# EAGLE design CV_slew_limiter (EAGLE 9.3.0)
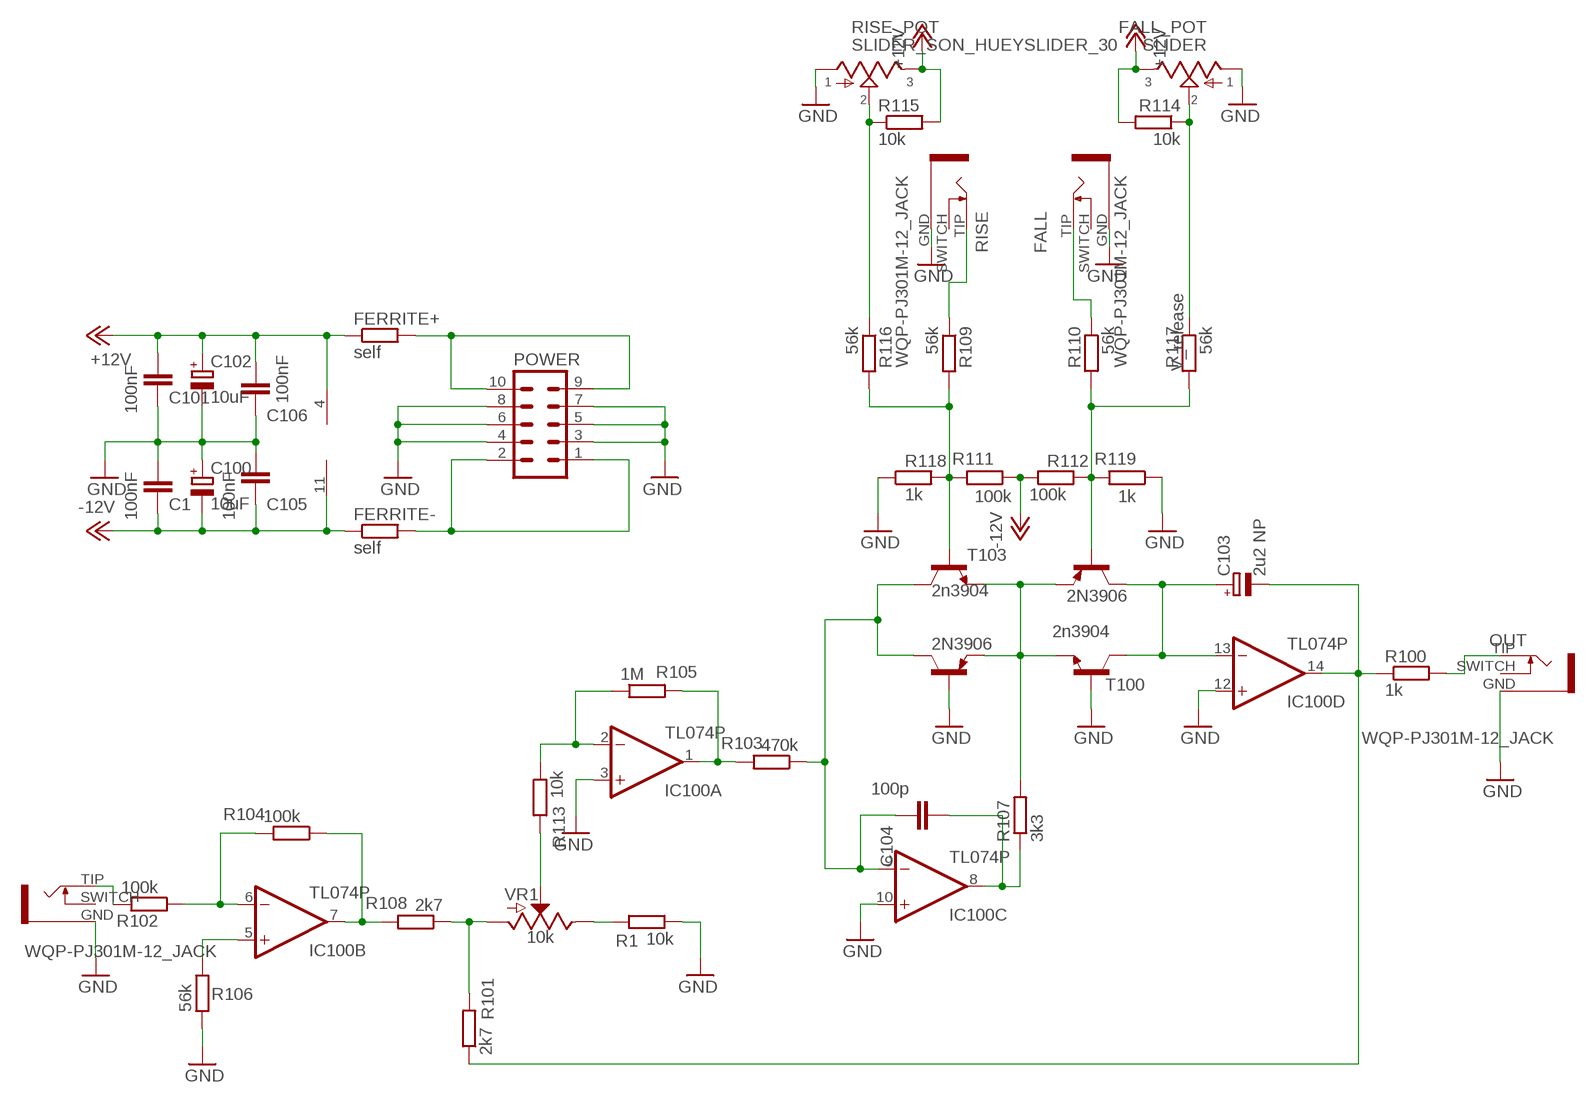
[diagram p0: schematic, sheet 1]

## Parts
C1  100nF  C-EU050-025X075  [C050-025X075]
C100  10uF  CPOL-EUE2-4  [E2-4]
C101  100nF  C-EU050-025X075  [C050-025X075]
C102  10uF  CPOL-EUE2-4  [E2-4]
C103  2u2 NP  CPOL-EUE2-4  [E2-4]
C104  100p  C-EU050-025X075  [C050-025X075]
C105  100nF  C-EU050-025X075  [C050-025X075]
C106  100nF  C-EU050-025X075  [C050-025X075]
FALL  WQP-PJ301M-12_JACK  [WQP-PJ301M-12_JACK]
FALL_POT  SLIDER  SLIDER_SON_HUEYSLIDER_30  [SILDER_30]
FERRITE+  self  R-EU_0204/5  [0204/5]
FERRITE-  self  R-EU_0204/5  [0204/5]
IC100  TL074P  [DIL14]
IN  WQP-PJ301M-12_JACK  [WQP-PJ301M-12_JACK]
OUT  WQP-PJ301M-12_JACK  [WQP-PJ301M-12_JACK]
POWER  ML10  [ML10]
R1  10k  R-EU_0204/5  [0204/5]
R100  1k  R-EU_0204/5  [0204/5]
R101  2k7  R-EU_0204/5  [0204/5]
R102  100k  R-EU_0204/5  [0204/5]
R103  470k  R-EU_0204/5  [0204/5]
R104  100k  R-EU_0204/5  [0204/5]
R105  1M  R-EU_0204/5  [0204/5]
R106  56k  R-EU_0204/5  [0204/5]
R107  3k3  R-EU_0204/5  [0204/5]
R108  2k7  R-EU_0204/5  [0204/5]
R109  56k  R-EU_0204/5  [0204/5]
R110  56k  R-EU_0204/5  [0204/5]
R111  100k  R-EU_0204/5  [0204/5]
R112  100k  R-EU_0204/5  [0204/5]
R113  10k  R-EU_0204/5  [0204/5]
R114  10k  R-EU_0204/5  [0204/5]
R115  10k  R-EU_0204/5  [0204/5]
R116  56k  R-EU_0204/5  [0204/5]
R117  56k  R-EU_0204/5  [0204/5]
R118  1k  R-EU_0204/5  [0204/5]
R119  1k  R-EU_0204/5  [0204/5]
RISE  WQP-PJ301M-12_JACK  [WQP-PJ301M-12_JACK]
RISE_POT  SLIDER_SON_HUEYSLIDER_30  [SILDER_30]
T100  2n3904  2N3904-NPN-TO92-EBC  [TO92-EBC]
T101  2N3906  2N3906-PNP-TO92-EBC  [TO92-EBC]
T102  2N3906  2N3906-PNP-TO92-EBC  [TO92-EBC]
T103  2n3904  2N3904-NPN-TO92-EBC  [TO92-EBC]
VR1  10k  POTENTIOMETER-PTH-9MM-1/20W-20%  [POT-PTH-ALPS]

## Nets
+12V: C101.2 C102.+ C106.2 FALL_POT.3 FERRITE+.1 IC100.4(P:V+) R114.2 R115.2 RISE_POT.3
-12V: C1.1 C100.- C105.1 FERRITE-.1 IC100.11(P:V-) R111.1 R112.1
GND: C1.2 C100.+ C101.1 C102.- C105.2 C106.1 FALL.GND FALL_POT.1 IC100.3(A:+IN) IC100.10(C:+IN) IC100.12(D:+IN) IN.GND OUT.GND POWER.3 POWER.4 POWER.5 POWER.6 POWER.7 POWER.8 R1.1 R106.2 R118.1 R119.1 RISE.GND RISE_POT.1 T100.B T102.B
IC25: C103.- IC100.14(D:OUT) R100.1 R101.1
N$1: OUT.TIP R100.2
N$2: R113.2 VR1.P$2(S)
N$3: R101.2 R108.1 VR1.P$3(A)
N$4: IN.TIP R102.2
N$5: R1.2 VR1.P$1(E)
N$8: FERRITE+.2 POWER.9 POWER.10
N$10: R107.2 T100.E T101.E T102.E T103.E
N$12: C103.+ IC100.13(D:-IN) T100.C T101.C
N$21: IC100.2(A:-IN) R105.1 R113.1
N$22: C104.1 IC100.9(C:-IN) R103.1 T102.C T103.C
N$23: C104.2 IC100.8(C:OUT) R107.1
N$24: R109.1 RISE.TIP
N$28: IC100.1(A:OUT) R103.2 R105.2
N$30: IC100.7(B:OUT) R104.1 R108.2
N$33: FERRITE-.2 POWER.1 POWER.2
N$35: IC100.6(B:-IN) R102.1 R104.2
N$37: IC100.5(B:+IN) R106.1
N$46: R115.1 R116.1 RISE_POT.2
N$49: FALL_POT.2 R114.1 R117.1
N$51: FALL.TIP R110.1
TO_ATTACK_CV: R109.2 R111.2 R116.2 R118.2 T103.B
TO_DECCAY_CV: R110.2 R112.2 R117.2 R119.2 T101.B
Unconnected: FALL.SWITCH IN.SWITCH OUT.SWITCH RISE.SWITCH

## Notes on the sheet
- V_release

## Library data of the parts
C1 C101 C104-C106 = rcl:C-EU: CAPACITOR, European symbol
C100 C102 C103 = rcl:CPOL-EU: POLARIZED CAPACITOR, European symbol
FALL IN OUT RISE = thonkiconn:WQP-PJ301M-12_JACK
FALL_POT RISE_POT = slider_son_huey:SLIDER_SON_HUEY
FERRITE+ FERRITE- R1 R100-R119 = rcl:R-EU_: RESISTOR, European symbol
IC100 = linear:TL074: OP AMP
POWER = con-ml:ML10: HARTING; OC_FARNELL: unknown; OC_NEWARK: unknown
T100 T103 = transistor-neu-to92:*-NPN-: NPN Transistror
T101 T102 = transistor-neu-to92:*-PNP-: PNP Transistror
VR1 = SparkFun-Resistors:POTENTIOMETER: Potentiometer (Pot) Three-terminal potentiometers, with an adjustable wiper and two adjustable resistors. A pot can be used to create a configurable voltage divider, or as a variable resistor. Variants ALPS_POT and ALPS_POT_KIT - PTH, breadboard compatible, 9mm square pots Rotary Potentiometer - Linear (10k ohm) <https://www.sparkfun.com/products/9288> (COM-09288) The KIT variant exposes copper on only one side of the PTH pad, so the part can only be assembled on one side of the PCB. Useful for beginner soldering kits.; PROD_ID: RES-09177; SF_SKU: COM-09288

## Board
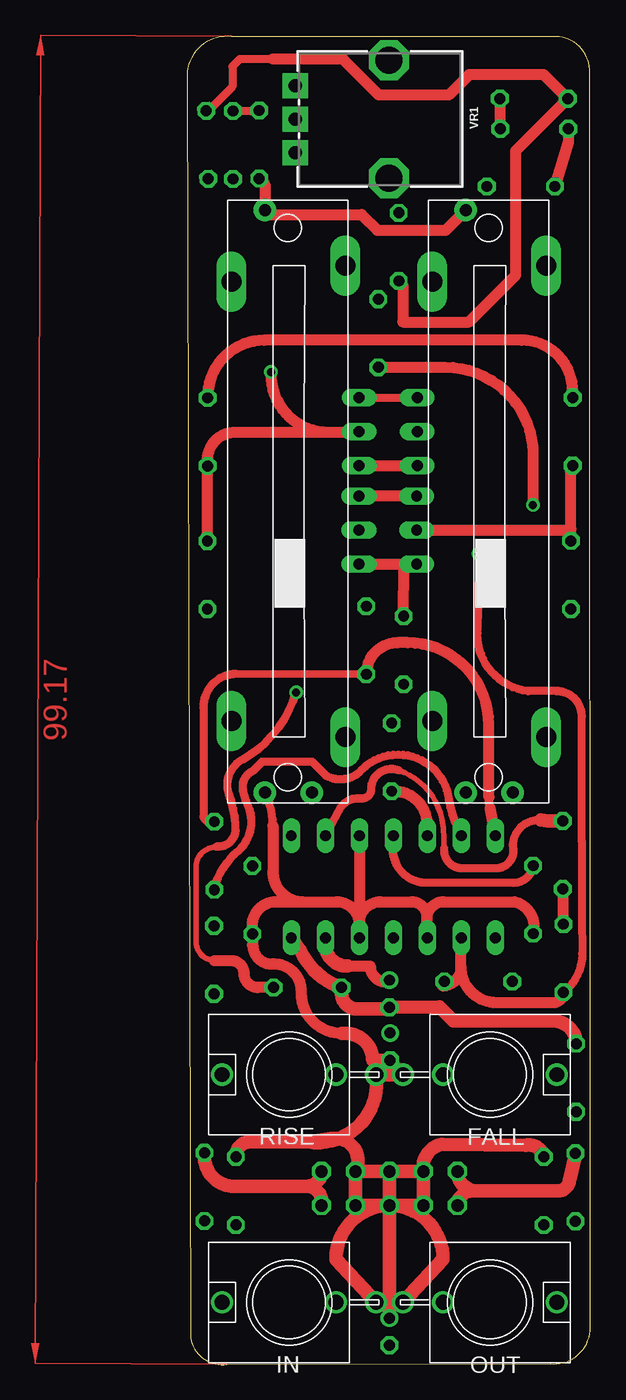
[diagram p1: board, top side]
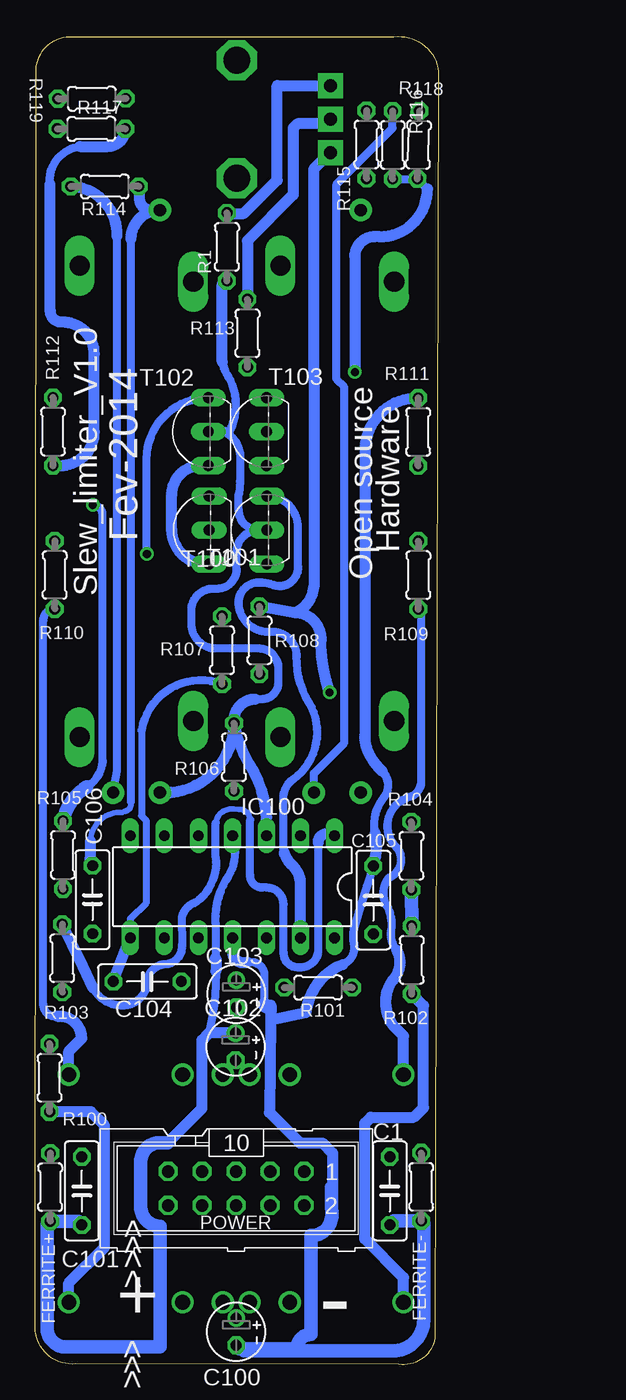
[diagram p2: board, bottom side, seen from below]

Size 30.12 x 99.16 mm. Coordinates in mm from the lower left corner, seen from the top.
Outline: 0,96.53 0.27,1.98 arc90 2.97,0.03 27.12,0.06 arc90 30.12,2.55 30.07,96.72 arc90 27.32,99.14 3.32,99.14 arc90 0,96.53
Copper layers (1*16): Top 0.035mm / dielectric 1.5mm / Bottom 0.035mm
Design rules "default": minimum track width 6mil, minimum drill 12mil, track to track 6mil, track to pad 6mil, pad to pad 6mil, via to via 6mil, smd to smd 0mil, copper to edge 10mil, drill to drill 10mil, minimum pad ring 10mil, minimum via ring 6mil, stop-mask expansion 2mil, vias tented up to drill 100mil, thermal gap 10mil

### Footprints (pad centres in the part's own frame; a part is rotated, then mirrored left to right if it is on the bottom)
C050-025X075 = drill 0.813 octagon: 1 -2.54,0; 2 2.54,0
E2-4 = drill 0.813 pad 1.27: + -1.016,0 | drill 0.813 pad 1.27 octagon: - 1.016,0
WQP-PJ301M-12_JACK = drill 1.1: GND 0,-6.5; SWITCH 0,-3.5; TIP 0,5
SILDER_30 = drill 0.9 pad 1.676: 1 -21.75,1.8; 2 -21.75,-1.7; 3 21.75,1.8 | drill 1.5 long: P$4 -17.6,-4.2; P$5 -16.4,4.3; P$6 16.4,4.3; P$7 17.6,-4.2
0204/5 = drill 0.813 octagon: 1 -2.54,0; 2 2.54,0
DIL14 = drill 0.813 long: 1 -7.62,-3.81; 2 -5.08,-3.81; 3 -2.54,-3.81; 4 0,-3.81; 5 2.54,-3.81; 6 5.08,-3.81; 7 7.62,-3.81; 8 7.62,3.81; 9 5.08,3.81; 10 2.54,3.81; 11 0,3.81; 12 -2.54,3.81; 13 -5.08,3.81; 14 -7.62,3.81
ML10 = drill 0.914 octagon: 1 -5.08,-1.27; 2 -5.08,1.27; 3 -2.54,-1.27; 4 -2.54,1.27; 5 0,-1.27; 6 0,1.27; 7 2.54,-1.27; 8 2.54,1.27; 9 5.08,-1.27; 10 5.08,1.27
TO92-EBC = drill 0.813 long: B 0,-1.27; C 2.54,-1.27; E -2.54,-1.27
POT-PTH-ALPS = drill 1 pad 1.88 square: P$1 7,-2.5; P$2 7,0; P$3 7,2.5 | drill 2 octagon: P$4 0,-4.4; P$5 0,4.4

### Placement (x,y rotation side)
C1  3.65,12.97 90 bottom
C100  15.12,2.46 270 bottom
C101  26.65,12.97 270 bottom
C102  15.17,23.74 270 bottom
C103  15.11,27.69 270 bottom
C104  21.76,28.6 180 bottom
C105  4.88,34.69 270 bottom
C106  25.85,34.71 90 bottom
FALL  22.62,21.65 270 top
FALL_POT  22.62,64.45 90 top
FERRITE+  29.01,13.25 90 bottom
FERRITE-  1.3,13.27 90 bottom
IC100  15.41,35.68 180 bottom
IN  7.62,4.65 90 top
OUT  22.62,4.65 270 top
POWER  15.12,13.15 180 bottom
R1  15.81,83.45 90 bottom
R100  29.06,21.42 270 bottom
R101  9,28.16 0 bottom
R102  2.01,30.21 270 bottom
R103  28.11,30.34 90 bottom
R104  2.03,37.99 270 bottom
R105  28.06,38.05 270 bottom
R106  15.28,45.35 90 bottom
R107  16.18,53.34 90 bottom
R108  13.39,54.08 270 bottom
R109  1.51,58.95 90 bottom
R110  28.67,58.96 90 bottom
R111  1.53,69.64 270 bottom
R112  28.8,69.66 270 bottom
R113  14.28,77.01 90 bottom
R114  24.93,87.96 0 bottom
R115  5.38,91.09 270 bottom
R116  3.43,91.06 270 bottom
R117  25.94,92.27 0 bottom
R118  1.51,91.08 268.3 bottom
R119  25.9,94.52 0.1 bottom
RISE  7.62,21.65 90 top
RISE_POT  7.62,64.45 90 top
T100  14.11,62.31 90 bottom
T101  18.42,62.32 90 bottom
T102  18.47,69.65 90 bottom
T103  14.12,69.67 90 bottom
VR1  15.08,92.98 180 top

### Tracks (layer width: path | path; a pad name or v marks a point on that pad's centre or on a via)
+12V
  Top 0.61: IC100.4 15.36,38.66 arc90 17.7,35.99 24.24,35.99 arc90 C106.2
  Top 0.813: FALL_POT.3 19.31,84.7 14.22,84.7 13.04,85.87 6.16,85.87 RISE_POT.3 5.82,88.11 R115.2
  Bottom 0.406: 22.97,42.02 arc90 23.47,41.3 23.65,41.24 arc-90 26.01,39.09
  Bottom 0.61: IC100.4 arc55 15.87,36.19 arc-31 16.66,33.01 16.66,30.34 | 22.97,42.02 22.97,84.06 | FALL_POT.3 21.49,86.2 | 22.34,87.96 arc-90 R114.2 | 16.64,29.4 arc16 17.15,24.8 arc-21 17.15,24.76
  Bottom 0.813: 26.01,39.09 26.01,37.8 arc-90 C106.2 | 22.97,84.06 arc90 FALL_POT.3 | 21.49,86.2 arc90 22.34,87.06 22.34,87.96 | C102.+ 17.15,24.76 17.68,24.23 17.68,19.13 20.23,16.58 | 16.66,30.34 16.64,30.31 16.64,29.4
  Bottom 1.016: 20.23,16.58 20.81,16.58 arc-90 22.26,15.13 22.26,11.8 arc-90 20.78,10.32 20.78,1.32 27.98,1.32 arc90 29.24,2.92 29.24,10.48 FERRITE+.1 26.93,10.71 C101.2
-12V
  Top 0.813: R112.1 28.8,72.68 arc90 24.99,76.49 5.75,76.49 arc90 R111.1
  Bottom 0.61: 13.01,27.03 13.02,29.02 arc-90 13.91,30.04 14.31,30.04 | 4.74,39.68 arc50 4.08,42.35 arc-86 4.22,44.32 | C105.1 arc-3 6.28,32.73 arc-27 6.33,31.44 arc80 7.18,29.86
  Bottom 0.813: 12.55,25.71 12.53,26.84 12.58,26.83 12.6,26.82 arc141 13.01,26.73 13.01,27.03 | 12.55,25.71 12.64,18.82 10.37,16.55 8.68,16.55 7.92,15.79 7.92,13.33 8,13.24 | 14.31,30.04 arc90 15.35,30.56 15.34,31.85 arc-90 IC100.11 | C105.1 arc-31 4.74,39.68 | 4.22,44.32 arc21 5.24,45.7 arc33 5.47,47.14 5.47,68.32 arc90 R111.1 | 7.18,29.86 arc-61 9.94,26.27 12.55,25.71
  Bottom 1.016: 8,13.24 arc-4 7.98,11.23 arc93 9.52,9.65 9.52,2.26 arc-90 10.58,1.2 14.87,1.2 C100.- 14.91,1.45 14.52,1.05 3.2,1.05 arc-90 1.12,3.53 1.12,10.55 arc-90 FERRITE-.1 3.35,10.73 C1.1
GND
  Top 0.61: POWER.7 17.66,14.47 | 6.4,40.24 arc26 RISE_POT.1 | 6.42,97.46 3.93,97.46 3.39,96.92 3.39,95.41 1.59,93.61 R118.1
  Top 0.813: 8.65,34.56 6.64,34.56 arc90 4.88,32.8 C105.2 4.88,31.33 4.93,31.29 arc90 6.31,29.9 6.52,29.9 arc-90 8.54,27.89 8.54,27.75 arc90 11.56,24.72 | 8.65,34.56 11.16,34.56 arc-90 12.85,32.87 12.85,32.02 arc-90 IC100.12 | IC100.12 12.85,32.94 arc-90 14.47,34.56 16.77,34.56 arc-90 17.91,33.41 17.91,32.03 arc90 IC100.10 17.93,33.32 arc-90 19.16,34.56 24.46,34.56 arc-90 C106.1 | IC100.3 IC100.12 | 6.4,40.24 6.4,36.81 arc90 8.65,34.56 | R1.1 16.11,80.61 16.11,77.85 21.07,77.85 24.55,81.33 24.55,90.62 R119.1 26.64,96.32 21.08,96.32 19.55,94.79 14.32,94.79 11.65,97.46 6.42,97.46
  Top 1.016: 17.66,14.47 arc-90 19.05,16.45 25.31,16.38 arc-90 C101.1 | POWER.6 POWER.4 POWER.3 | POWER.6 POWER.8 POWER.7 POWER.5 | 9.07,16.62 arc106 RISE.GND FALL.GND 15.17,22.61 C102.- 13.87,22.73 arc90 11.87,24.72 11.56,24.72 | 9.07,16.62 10.81,16.89 arc-126 POWER.3 | IN.GND 11.12,7.88 arc-90 POWER.6 | OUT.GND 19.12,7.88 arc90 POWER.6 | POWER.6 C100.+ | C1.2 3.65,15.6 arc-90 4.68,16.63 9.06,16.63 arc-90 9.07,16.62 | POWER.6 POWER.5 | POWER.3 POWER.5
  Bottom 0.61: T102.B 16.15,69.7 | 16.15,69.7 arc66 14.83,67.85 arc7 14.91,65.01 arc-90 14.93,64.99 14.93,63.81 arc-90 13.44,62.31 | 16.16,74.87 arc-26 15.56,73.52 arc50 15.63,69.64 arc-21 16.15,69.7 | T100.B 13.44,62.31 | 13.44,62.31 arc-90 15.08,60.66 15.08,59.38 arc90 16.52,57.94 16.83,57.94 arc-90 18.46,56.31 18.46,55.29 arc-90 16.63,53.47 13.43,53.47 arc90 11.96,52 11.96,50.93 arc90 13.2,49.7 13.68,49.7 | R106.2 15.28,48.09
  Bottom 0.813: FALL_POT.1 20.47,42.7 arc-90 R106.2 arc-22 13.76,44.16 arc33 IC100.3 | 15.28,48.09 arc90 13.68,49.7 | 16.16,74.87 16.16,80.56 arc90 R1.1
IC25
  Top 1.016: IC100.14 arc-6 8.72,30.49 arc43 R101.1 11.54,27.73 arc90 12.71,26.56 15,26.56 arc-90 C103.- 18.85,26.7 19.88,25.67 27.35,25.67 arc-90 R100.1
N$1
  Bottom 0.813: OUT.TIP 27.62,6.1 24.96,8.76 24.96,17.86 25.97,18.88 R100.2
N$2
  Bottom 0.813: VR1.P$2 8.44,92.63 10.56,92.63 10.86,92.33 10.86,87.33 14.28,83.91 R113.2
N$3  (via drill 0.6 pad 1.02)
  Top 0.406: 2.17,38.66 arc90 0.66,37.06 0.66,31.66 arc90 2.05,30.17
  Top 0.61: v8.14,50.19 arc-44 4.17,45.2 arc82 3.14,42.56 arc-20 3.63,39.86 arc-90 2.24,38.69 2.17,38.66
  Top 0.813: 2.05,30.17 3.27,30.17 arc-90 4.26,29.19 arc90 5.29,28.16 R101.2
  Bottom 0.813: R108.1 10.7,56.14 | 10.7,56.14 arc-62 9.33,58.07 9.33,89.24 VR1.P$3 | v8.14,50.19 arc17 8.8,53.91 arc-97 10.7,56.14
N$4
  Bottom 0.813: IN.TIP 2.62,6.5 5.51,9.39 5.51,18.03 5.07,18.46 1.85,18.46 1.13,19.18 1.13,26.8 R102.2
N$5
  Bottom 0.813: R1.2 15.76,85.94 14.56,85.94 12.07,88.42 12.07,95.48 VR1.P$1
N$8
  Top 1.016: FERRITE+.2 29.01,15.57 28.57,13.85 arc-90 27.69,12.97 21.65,12.97 | 21.65,12.97 arc-90 POWER.9 | POWER.10 arc-90 21.29,12.97 21.65,12.97
N$10
  Top 0.61: T101.E arc-90 T101.E 16.13,59.77 arc-90 16.21,59.7 | 17.14,67.13 arc90 T102.E
  Top 0.813: T100.E 16.13,59.77 | T103.E 17.14,67.13 | R107.2 16.21,59.7
  Bottom 0.813: T101.E 17.37,59.78 arc90 19.93,62.33 19.93,64.94 arc90 17.73,67.14 17.19,67.14 arc-90 T102.E
N$12
  Top 0.61: T100.C arc90 T100.C
  Top 0.813: T101.C T100.C | 11.97,29.76 13.68,29.76 arc90 14.88,28.56 arc-90 15.03,28.71 C103.+
  Top 1.016: IC100.13 10.31,31.42 arc90 11.97,29.76
  Bottom 0.61: 11.53,38.22 arc25 11.59,38.82 11.59,42.27 arc54 10.84,43.74 arc-86 9.68,49.43 arc33 10.6,52.85 arc-96 12.54,54.71 arc90 14.94,56.77 arc93 13.44,58.41 arc21 12.36,58.22 arc-118 10.51,59.7 10.51,62.52 arc-90 T100.C
  Bottom 0.813: IC100.13 10.32,35.91 arc-47 10.89,37.23 arc28 11.53,38.22
N$21  (via drill 0.6 pad 1.02)
  Top 0.406: 15.8,44.38 arc-59 19.03,40.75 arc-11 19.19,38.58
  Top 0.61: IC100.2 11.53,41.7 arc-58 12.97,42.28 arc97 13.76,42.98 arc-112 15.8,44.38 | 19.19,38.58 arc96 20.53,37.07 23.21,37.07 arc90 23.21,37.08 arc96 24.35,38.61 arc-99 26.41,40.65
  Top 0.813: R113.1 19.28,74.47 arc-90 25.84,67.9 v25.84,64.19 arc-90 v25.83,64.18
  Top 1.016: 26.41,40.65 arc12 R105.1
  Bottom 0.61: 26.27,43.14 arc-53 25.08,45.01 25.08,45.05 arc-90 25.1,45.07 25.1,63.45 arc-90 v25.83,64.18
  Bottom 1.016: 26.27,43.14 arc-47 R105.1
N$22  (via drill 0.6 pad 1.02)
  Top 0.61: T103.C 17.14,72.21 arc90 T102.C | v21.79,60.53 arc90 21.86,60.46 21.72,55 arc90 25.46,50.29 27.59,50.29 arc-90 29.49,48.39 29.49,39.04 arc0 29.52,30.69 arc-53 R103.1
  Top 0.813: C104.1 19.09,28.29 arc90 20.47,29.67 | 20.47,29.67 20.47,32.01 arc90 IC100.9 | R103.1 arc-90 27.33,27.02 24.35,27.02 23.11,27.02 arc-90 20.47,29.67
  Bottom 0.61: v21.79,60.53 21.81,67.63 arc90 T102.C
N$23
  Bottom 0.508: IC100.8 23.03,33.28 21.86,34.45 21.86,40.64 22.19,40.97 22.19,47.35
  Bottom 0.61: R107.1 arc-101 22.19,47.35
  Bottom 0.813: C104.2 IC100.8
N$24
  Bottom 0.61: 3.13,30.94 arc50 3.53,32.45 arc-34 3.78,34.1 arc72 3.74,36.34 arc-102 3.03,38.5 arc124 2.13,42.41 arc-66 1.29,43.4 1.29,56.19 arc-90 R109.1
  Bottom 0.813: 3.13,30.94 arc73 3.46,28.66 arc-70 3.34,25.26 2.62,24.54 RISE.TIP
N$28
  Top 0.813: R103.2 28.11,35.46 arc90 R105.2
  Bottom 0.406: 16.64,40.46 arc90 15.3,41.47 14.91,41.47 arc90 14.08,40.67
  Bottom 0.61: 16.64,40.46 16.64,37.86 arc60 18.13,34.52 arc-59 19.18,33.41 19.18,31.32 arc95 20.47,29.89 arc-87 21.8,28.35 arc72 23.26,26.85 arc72 25.8,28.1 | 9,38.99 9,30.96 arc90 10.31,29.66 10.5,29.66 arc90 11.58,30.74 11.58,34.36 arc-90 12.83,35.61 13.18,35.61 arc90 14.08,36.55 14.08,40.67
  Bottom 0.813: 25.8,28.1 arc0 R103.2 | IC100.1 8.35,39.63 arc-90 9,38.99
N$30
  Top 0.61: R108.2 3.63,51.57 arc90 1.23,49.06 1.23,40.9 arc90 R104.1 | 22.64,41.54 arc-27 22.55,42.36
  Top 0.813: IC100.7 22.64,41.54 | 22.55,42.36 22.53,47.81 arc90 16.47,53.9 15.75,53.9 arc90 R108.2
N$33
  Top 1.016: 8.93,13.32 arc90 POWER.1 | 8.93,13.32 arc-90 10.04,12.21 POWER.2 | 8.93,13.32 3.33,13.32 arc-90 FERRITE-.2
N$35
  Top 0.61: IC100.6 arc-22 19.55,42.17 arc133 12.83,44.19 arc-70 10.36,43.98 9.37,44.98 9.37,45.01 5.59,45.01 4.88,44.3 arc80 4.18,42.89 arc10 4.57,41.7 arc-71 3.85,38.37 arc38 R104.2
  Bottom 1.016: R102.1 R104.2
N$37
  Top 0.813: R106.1 15.47,42.81 arc-90 17.91,40.37 17.91,39.65 arc90 IC100.5
N$46
  Top 0.61: R116.1 3.46,93.63 R115.1
  Bottom 0.61: RISE_POT.2 9.32,44.15 7.04,46.43 7.04,72.97 7.61,73.55 7.61,88.14 3.43,92.32 R116.1
N$49
  Top 0.813: R117.1 28.48,91.3 R114.1
  Bottom 0.61: FALL_POT.2 24.02,44.31 24.02,84.26
  Bottom 0.813: 24.02,84.26 arc-90 R114.1
N$51
  Bottom 0.61: 28.5,26 28.64,26 arc90 29.52,26.88 29.52,55.57 arc90 R110.1
  Bottom 0.813: 28.5,26 28.3,26 arc90 26.66,24.37 27.62,23.4 FALL.TIP
TO_ATTACK_CV  (via drill 0.6 pad 1.02)
  Top 0.61: 1.51,67.08 arc-90 R111.2
  Top 0.813: R109.2 1.51,67.08 | 10.57,69.62 8.14,69.62 arc90 8.14,69.62 3.59,69.62 arc90 1.53,67.56 R111.2 | 10.57,69.62 12.68,69.62 arc90 T103.B | v6.26,74.11 6.26,73.93 arc90 10.57,69.62
  Bottom 0.61: 0.84,87.76 1.61,88.54 | 1.61,88.54 1.71,88.63 1.82,88.52 R116.2 | 1.61,88.54 R118.2
  Bottom 0.813: 0.84,87.76 arc90 4.4,84.2 4.8,84.2 arc-90 6.26,82.74 v6.26,74.11 arc-90 v6.26,74.11
TO_DECCAY_CV
  Top 0.61: 28.67,66.99 arc-90 R112.2 | 28.64,62.32 arc90 28.67,62.35
  Top 0.813: R110.2 28.67,62.35 28.67,66.99 | T101.B 28.64,62.32 | R117.2 23.4,94.52 arc90 R119.2
  Bottom 0.61: R112.2 28.25,67.12 | 28.08,77.83 28.18,77.83 | 29.03,88.11 arc90 26.79,90.94
  Bottom 0.813: 28.25,67.12 arc-90 25.72,69.66 25.72,75.47 arc-90 28.08,77.83 | 28.18,77.83 arc90 29.01,78.66 29.03,88.11 | 26.79,90.94 24.72,90.94 arc-90 R117.2
(copper drawn outside any net)
  shapes: Top area x1

### Text on the board
bPlace: Open source | Hardware | Fev-2014 | Slew_limiter_V1.0 | > | > | > | > | > | > | >
bNames: + | -